# Altium schematic sheet USB_SWITCH.SchDoc
size 420 x 297 mm; SheetNumber: 13; SheetTotal: 23
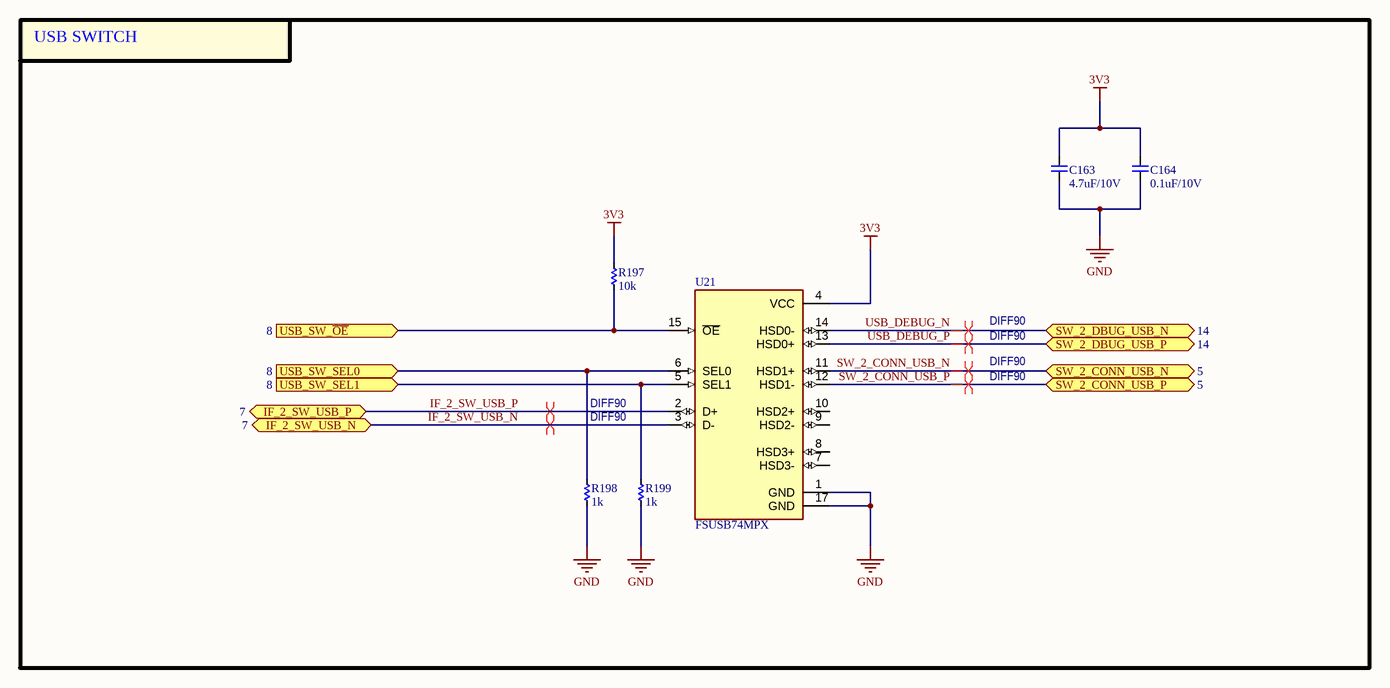
[diagram p0: USB_SWITCH.SchDoc]

## Parts
C163  4.7uF/10V  [CAP_C_1005X50_L]
C164  0.1uF/10V  [CAP_C_1005X50_L]
R197  10k  [RES_C_1005x30_L]
R198  1k  [RES_C_1005x30_L]
R199  1k  [RES_C_1005x30_L]
U21  FSUSB74MPX  [QFN50P300X300X80-17N]

## Blocks framed on the sheet
USB SWITCH: C163 C164 R197-R199 U21

## Ports
IF_2_SW_USB_N (bidir, see 7), IF_2_SW_USB_P (bidir, see 7), SW_2_CONN_USB_N (bidir, see 5), SW_2_CONN_USB_P (bidir, see 5), SW_2_DBUG_USB_N (bidir, see 14), SW_2_DBUG_USB_P (bidir, see 14), USB_SW_SEL0 (in, see 8), USB_SW_SEL1 (in, see 8), USB_SW_~{OE} (in, see 8)

## Nets
3V3: C163.2 C164.2 R197.2 U21.4(VCC)
GND: C163.1 C164.1 R198.1 R199.1 U21.1(GND) U21.17(GND)
IF_2_SW_USB_N: U21.3(D-) ; port IF_2_SW_USB_N
IF_2_SW_USB_P: U21.2(D+) ; port IF_2_SW_USB_P
SW_2_CONN_USB_N: U21.11(HSD1+) ; port SW_2_CONN_USB_N
SW_2_CONN_USB_P: U21.12(HSD1-) ; port SW_2_CONN_USB_P
USB_DEBUG_N: U21.14(HSD0-) ; port SW_2_DBUG_USB_N
USB_DEBUG_P: U21.13(HSD0+) ; port SW_2_DBUG_USB_P
USB_SW_~{OE}: R197.1 U21.15(~{OE}) ; port USB_SW_~{OE}
USB_SW_SEL0: R198.2 U21.6(SEL0) ; port USB_SW_SEL0
USB_SW_SEL1: R199.2 U21.5(SEL1) ; port USB_SW_SEL1

Not connected (* = marked no-connect by the designer): U21 7(HSD3-) 8(HSD3+) 9(HSD2-) 10(HSD2+)

## Layout directives
differential pair; differential pair class DIFF90; net class DIFF90; rule Matched Net Lengths [Tolerance = 4mil]: IF_2_SW_USB_N, IF_2_SW_USB_P, SW_2_CONN_USB_N, SW_2_CONN_USB_P, USB_DEBUG_N, USB_DEBUG_P

## Notes on the sheet
- Project:
- BEE-1012
- Sub-system:
- SATELLITE_EXP_CONTROLLER
- Design by:
- SANG HUYNH
- BAO BUI
- Sheet title:
- Sheet
- A3
- of
- Checked by:
- Approved by:
- VU PHAM
- Revision:
- Document No:
- Size:
- Date:

## Library data of the parts
C163 C164 = _CAP_C_2: CAP CHIP
R197-R199 = _RES_B_2: RES
U21 = IC_USB_SW_FSUSB74MPX: USB Switch IC 1 Channel 16-MLP (3x3); MF: ON Semiconductor; SnapEDA_Link: https://www.snapeda.com/parts/FSUSB74MPX/Onsemi/view-part/?ref=snap; Package: WQFN-16 ON Semiconductor; Value: *; MP: FSUSB74MPX; Check_prices: https://www.snapeda.com/parts/FSUSB74MPX/Onsemi/view-part/?ref=eda